# EAGLE schematic PN9999_ExampleBoardDesign (EAGLE 8.5.0)
APPROVED_BY: <ADD APPROVER>; APPROVED_DATE: <ADD APPROVER>; COMPANY_NAME: Audioptics Medical Inc.; DRAWING_TITLE: <ADD DRAWING TITLE>; DRAWN_BY: <ADD NAME>; DRAWN_DATE: <ADD DATE>; PARTNUMBER: <ADD PART NUMBER>; PROJECT_NAME: <ADD PROJECT NAME>; REVISION: DRAFT0001
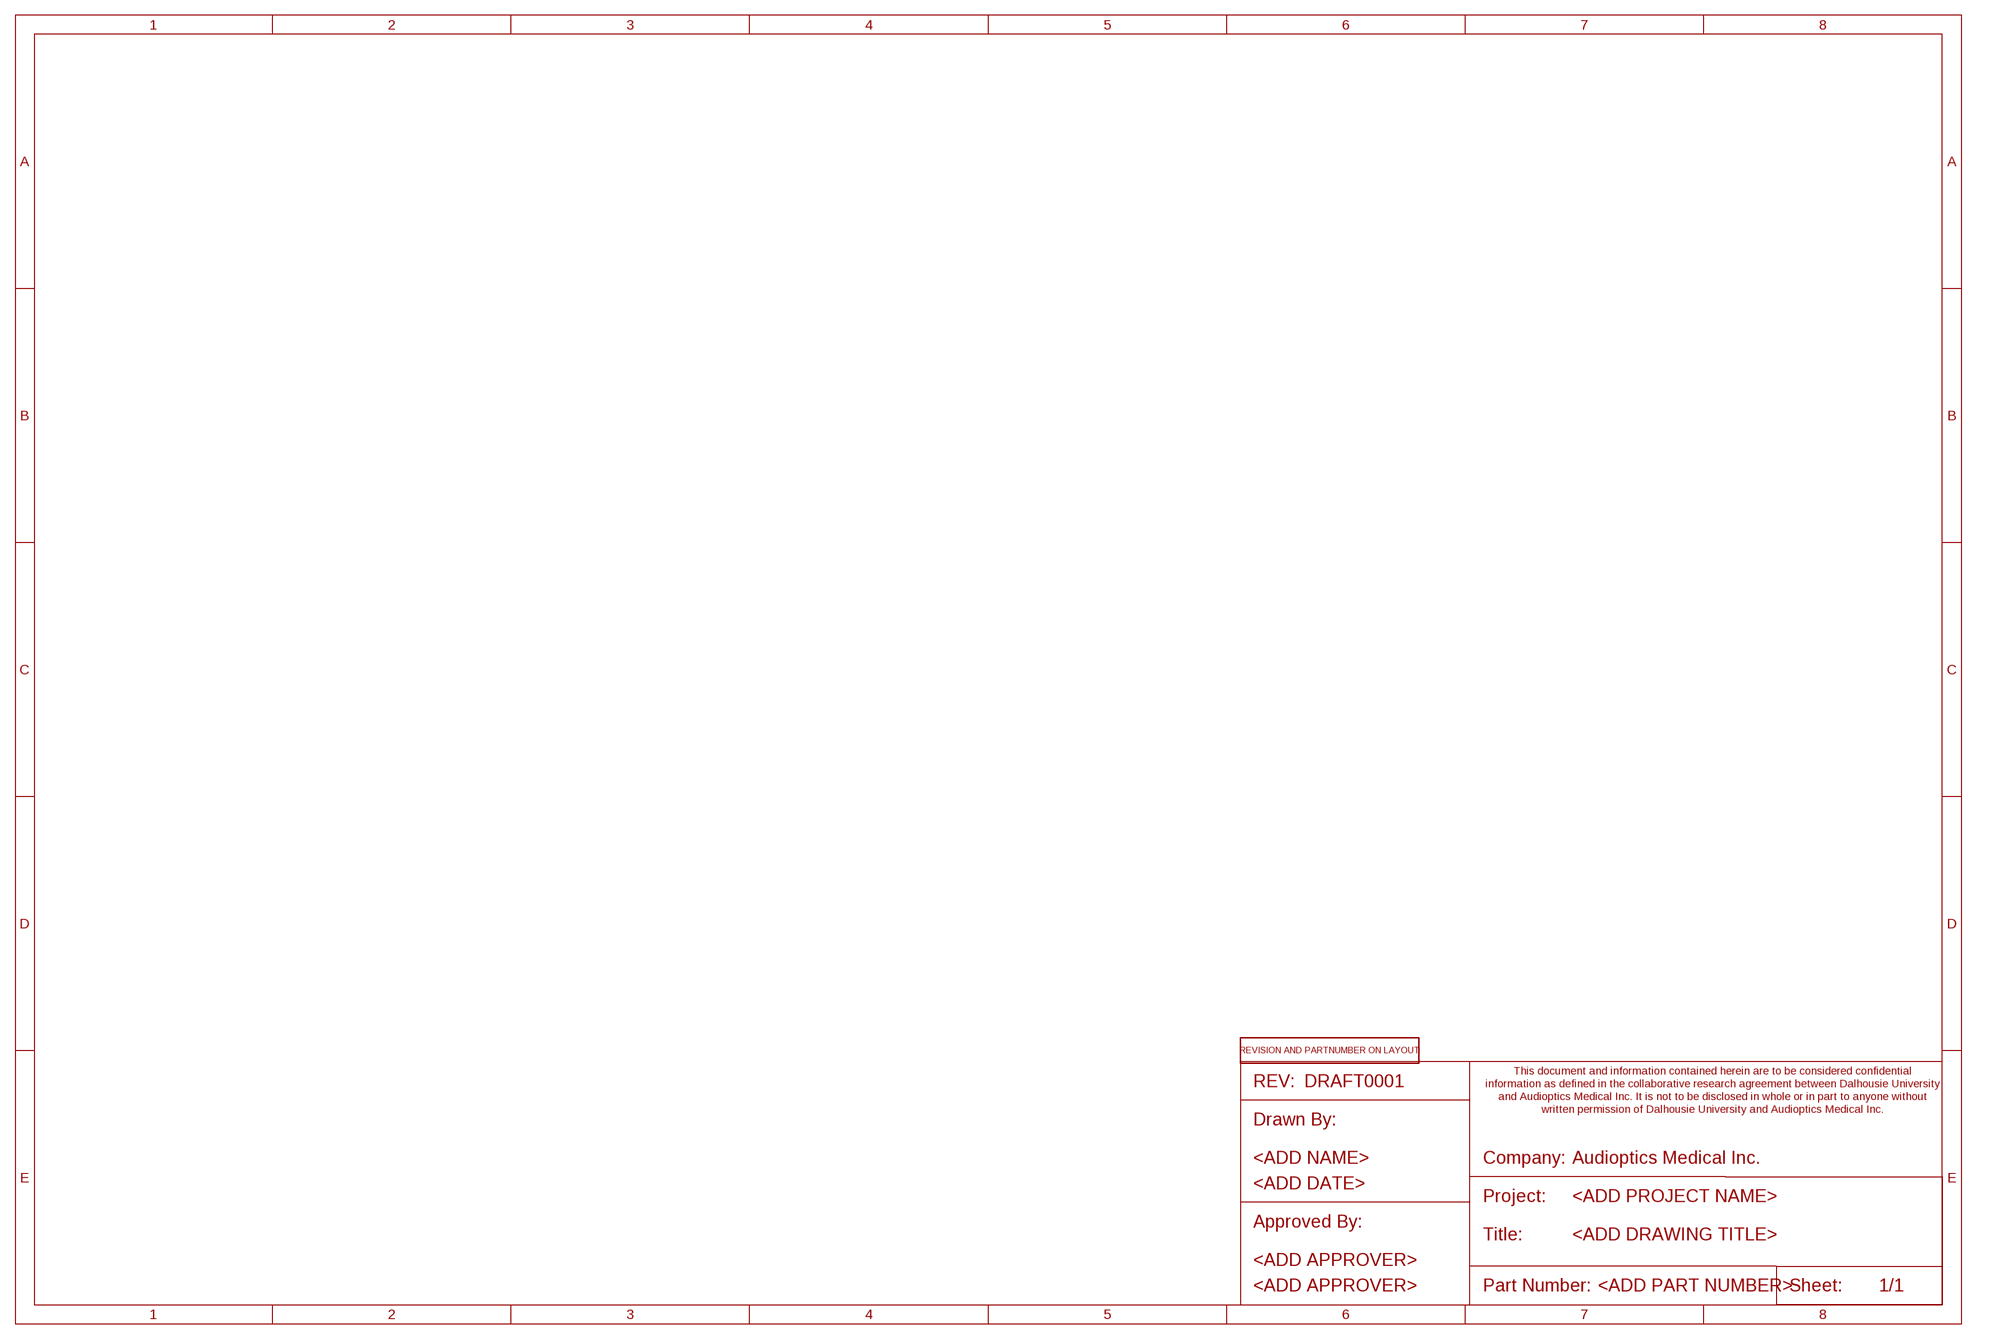
[diagram p0: schematic, sheet 1]

## Parts
U$2  AO_BOARD_PN_REV  [BOARD_SILK]

## Library data of the parts
U$2 = Audioptics_Frame:AO_BOARD_PN_REV